# EAGLE design Fermento_1side (EAGLE 6.5.0)
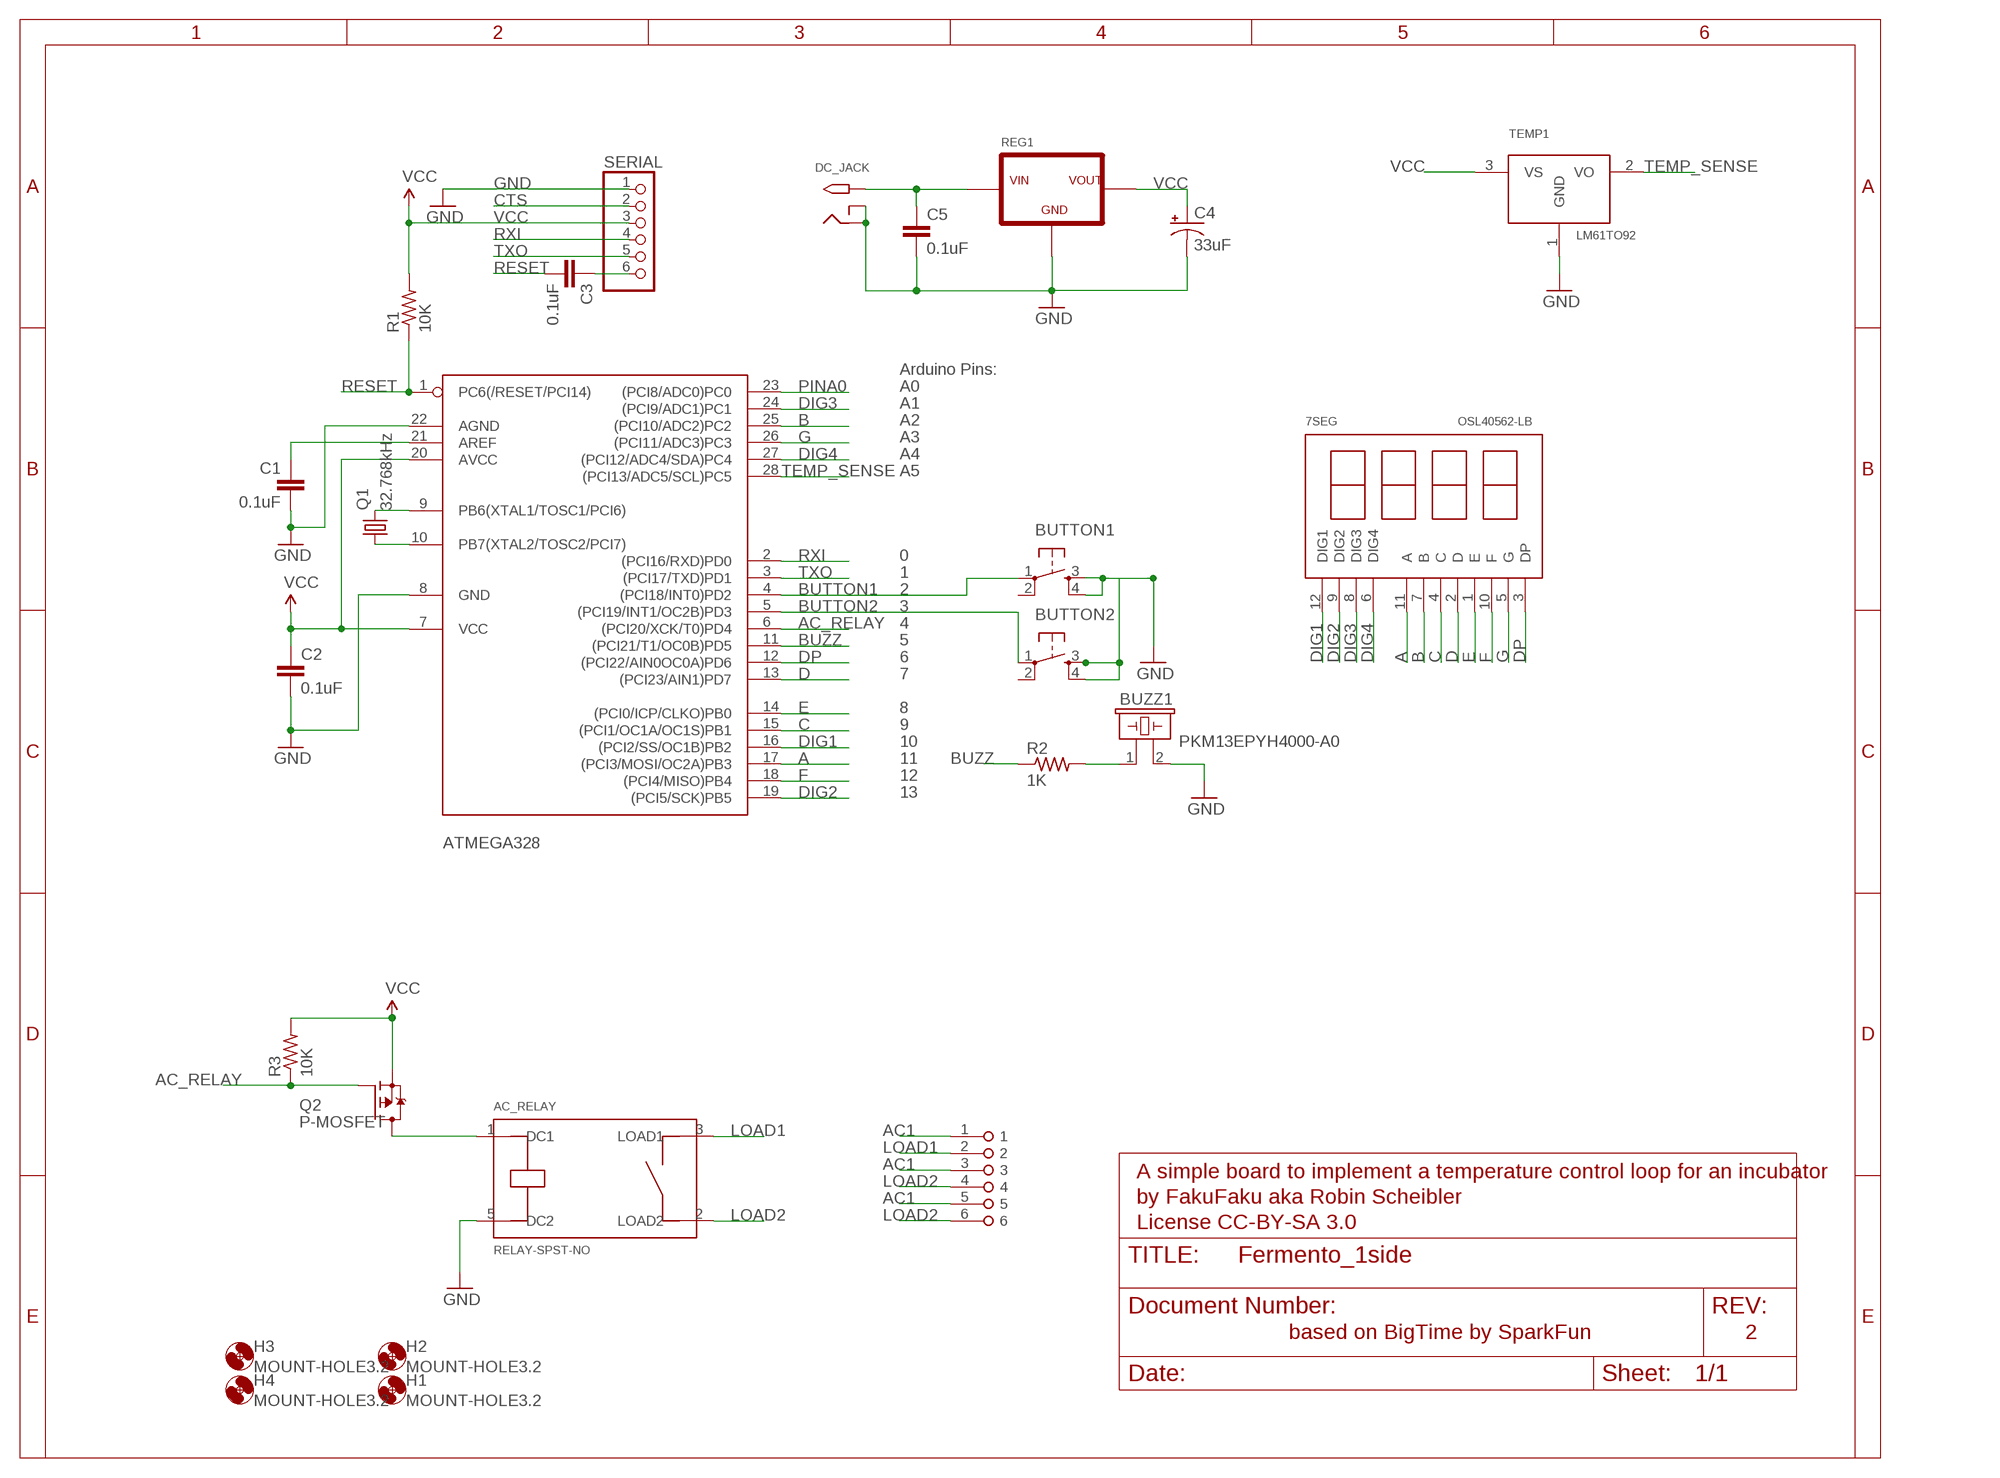
[diagram p0: schematic, sheet 1]

## Parts
7SEG  OSL40562-LB  7SEG  [OSL40562]
AC_RELAY  RELAY-SPST-NO  [G6RL-1A-DC3]
ATMEGA328  ATMEGA168-20P  [DIL28-3]
BUTTON1  TAC_SWITCHPTH  [TACTILE-PTH]
BUTTON2  TAC_SWITCHPTH  [TACTILE-PTH]
BUZZ1  PKM13EPYH4000-A0  BUZZER13MM  [PIEZO-MURATA-13MM]
C1  0.1uF  CAPPTH  [CAP-PTH-SMALL]
C2  0.1uF  CAPPTH  [CAP-PTH-SMALL]
C3  0.1uF  CAPPTH  [CAP-PTH-SMALL]
C4  33uF  CAP_POLPTH2  [CPOL-RADIAL-10UF-25V]
C5  0.1uF  CAPPTH  [CAP-PTH-SMALL]
DC_JACK  2.1MMJACKTHM  [PJ-102A]
H1  MOUNT-HOLE3.2  [3,2]
H2  MOUNT-HOLE3.2  [3,2]
H3  MOUNT-HOLE3.2  [3,2]
H4  MOUNT-HOLE3.2  [3,2]
Q1  32.768kHz  CRYSTAL8X3  [CRYSTAL-8X3-TH]
Q2  P-MOSFET  [TO92-]
R1  10K  R-US_0207/10  [0207/10]
R2  1K  R-US_0207/10  [0207/10]
R3  10K  R-US_0207/10  [0207/10]
REG1  REGULATOR-NOTHERMAL-TO220-STRAIGHT  [TO-220-STRAIGHT]
SERIAL  PINHD-1X6/90  [1X06/90]
TEMP1  LM61TO92  [TO92-]
U$2  TERMINAL-6  [MBE-156]

## Nets
A: 7SEG.11(A) ATMEGA328.17((PCI3/MOSI/OC2A)PB3)
AC1: U$2.1 U$2.3 U$2.5
AC_RELAY: ATMEGA328.6((PCI20/XCK/T0)PD4) Q2.2(G) R3.1
AREF: ATMEGA328.21(AREF) C1.1
B: 7SEG.7(B) ATMEGA328.25((PCI10/ADC2)PC2)
BUTTON1: ATMEGA328.4((PCI18/INT0)PD2) BUTTON1.1
BUTTON2: ATMEGA328.5((PCI19/INT1/OC2B)PD3) BUTTON2.1
BUZZ: ATMEGA328.11((PCI21/T1/OC0B)PD5) R2.1
C: 7SEG.4(C) ATMEGA328.15((PCI1/OC1A/OC1S)PB1)
CTS: SERIAL.2
D: 7SEG.2(D) ATMEGA328.13((PCI23/AIN1)PD7)
DIG1: 7SEG.12(DIG1) ATMEGA328.16((PCI2/SS/OC1B)PB2)
DIG2: 7SEG.9(DIG2) ATMEGA328.19((PCI5/SCK)PB5)
DIG3: 7SEG.8(DIG3) ATMEGA328.24((PCI9/ADC1)PC1)
DIG4: 7SEG.6(DIG4) ATMEGA328.27((PCI12/ADC4/SDA)PC4)
DP: 7SEG.3(DP) ATMEGA328.12((PCI22/AIN0OC0A)PD6)
E: 7SEG.1(E) ATMEGA328.14((PCI0/ICP/CLKO)PB0)
F: 7SEG.10(F) ATMEGA328.18((PCI4/MISO)PB4)
G: 7SEG.5(G) ATMEGA328.26((PCI11/ADC3)PC3)
GND: AC_RELAY.5(DC2) ATMEGA328.8(GND) ATMEGA328.22(AGND) BUTTON1.3 BUTTON1.4 BUTTON2.3 BUTTON2.4 BUZZ1.2 C1.2 C2.2 C4.2(-) C5.2 DC_JACK.RING DC_JACK.RING_SW REG1.CENTER(GND) SERIAL.1 TEMP1.1(GND)
LOAD1: AC_RELAY.3(LOAD1) U$2.2
LOAD2: AC_RELAY.2(LOAD2) U$2.4 U$2.6
N$1: ATMEGA328.9(PB6(XTAL1/TOSC1/PCI6)) Q1.2
N$2: ATMEGA328.10(PB7(XTAL2/TOSC2/PCI7)) Q1.1
N$3: C5.1 DC_JACK.TIP REG1.LEFT(VIN)
N$7: C3.1 SERIAL.6
N$13: BUZZ1.1 R2.2
PINA0: ATMEGA328.23((PCI8/ADC0)PC0)
RELAY: AC_RELAY.1(DC1) Q2.1(D)
RESET: ATMEGA328.1(PC6(/RESET/PCI14)) C3.2 R1.1
RXI: ATMEGA328.2((PCI16/RXD)PD0) SERIAL.4
TEMP_SENSE: ATMEGA328.28((PCI13/ADC5/SCL)PC5) TEMP1.2(VO)
TXO: ATMEGA328.3((PCI17/TXD)PD1) SERIAL.5
VCC: ATMEGA328.7(VCC) ATMEGA328.20(AVCC) C2.1 C4.1(+) Q2.3(S) R1.2 R3.2 REG1.RIGHT(VOUT) SERIAL.3 TEMP1.3(VS)
Unconnected: BUTTON1.2 BUTTON2.2

## Notes on the sheet
- Arduino Pins:
- A0
- A1
- A2
- A3
- A4
- A5
- 0
- 1
- 2
- 3
- 4
- 5
- 6
- 7
- 8
- 9
- 10
- 11
- 12
- 13
- A simple board to implement a temperature control loop for an incubator
- by FakuFaku aka Robin Scheibler
- License CC-BY-SA 3.0
- based on BigTime by SparkFun | 2

## Library data of the parts
7SEG = Robin:7SEG
AC_RELAY = Robin:RELAY-SPST-NO
ATMEGA328 = adafruit:ATMEGA168*P: MICROCONTROLLER 16 kBytes FLASH 1 kBytes SRAM 512 Bytes EEPROM USART 8-channel 10 bit ADC
BUTTON1 BUTTON2 = SparkFun:TAC_SWITCH: Momentary Switch Button commonly used for reset or general input. Spark Fun Electronics SKU : COM-00097
BUZZ1 = Robin:BUZZER: BUZZER Source: muRata
C1-C3 C5 = SparkFun:CAP: Capacitor Standard 0603 ceramic capacitor, and 0.1" leaded capacitor.
C4 = SparkFun:CAP_POL: Capacitor Polarized These are standard SMD and PTH capacitors. Normally 10uF, 47uF, and 100uF in electrolytic and tantalum varieties. Always verify the external diameter of the through hole cap, it varies with capacity, voltage, and manufacturer. The EIA devices should be standard.
DC_JACK = adafruit:2.1MMJACK: 2.1mm x 5.5mm THM DC jack with internal switch. Digikey part #PJ-102A, 4UCON part #05537 2.1mm x 5.5mm SMT DC jack with internal switch. Digikey part #PJ-002A-SMT, 4UCON part #03267 By microbuilder.eu & adafruit.com
H1-H4 = holes:MOUNT-HOLE: MOUNTING HOLE with drill center marker
Q1 = Robin:CRYSTAL
Q2 = Robin:P-MOSFET
R1-R3 = adafruit:R-US_: RESISTOR, American symbol
REG1 = Robin:REGULATOR-NOTHERMAL
SERIAL = pinhead:PINHD-1X6: PIN HEADER
TEMP1 = Robin:LM61: The LM61 is a precision integrated-circuit temperature sensor that can sense a ?30°C to +100°C temperature range while operating from a single +2.7V supply. The LM61's output volt- age is linearly proportional to Celsius (Centigrade) tempera- ture (+10 mV/°C) and has a DC offset of +600 mV. The offset allows reading negative temperatures without the need for a negative supply. The nominal output voltage of the LM61 ranges from +300 mV to +1600 mV for a ?30°C to +100°C temperature range. The LM61 is calibrated to provide accu- racies of ±2.0°C at room temperature and ±3°C over the full ?25°C to +85°C temperature range.
U$2 = Robin:TERMINAL-6

## Board
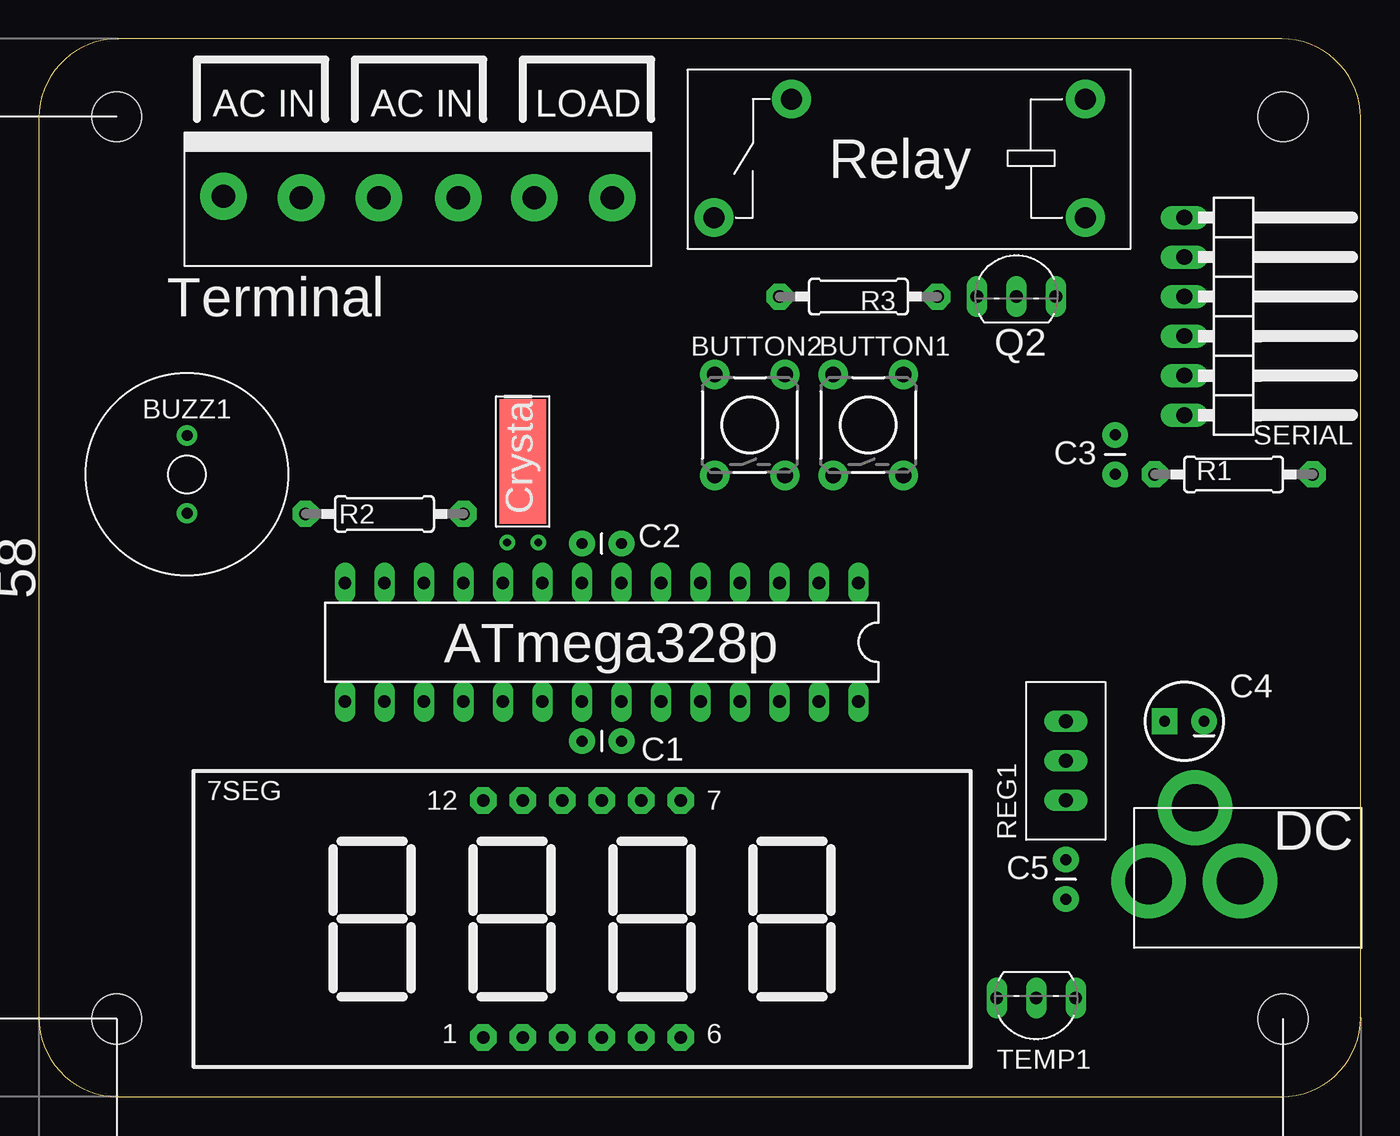
[diagram p1: board, top side]
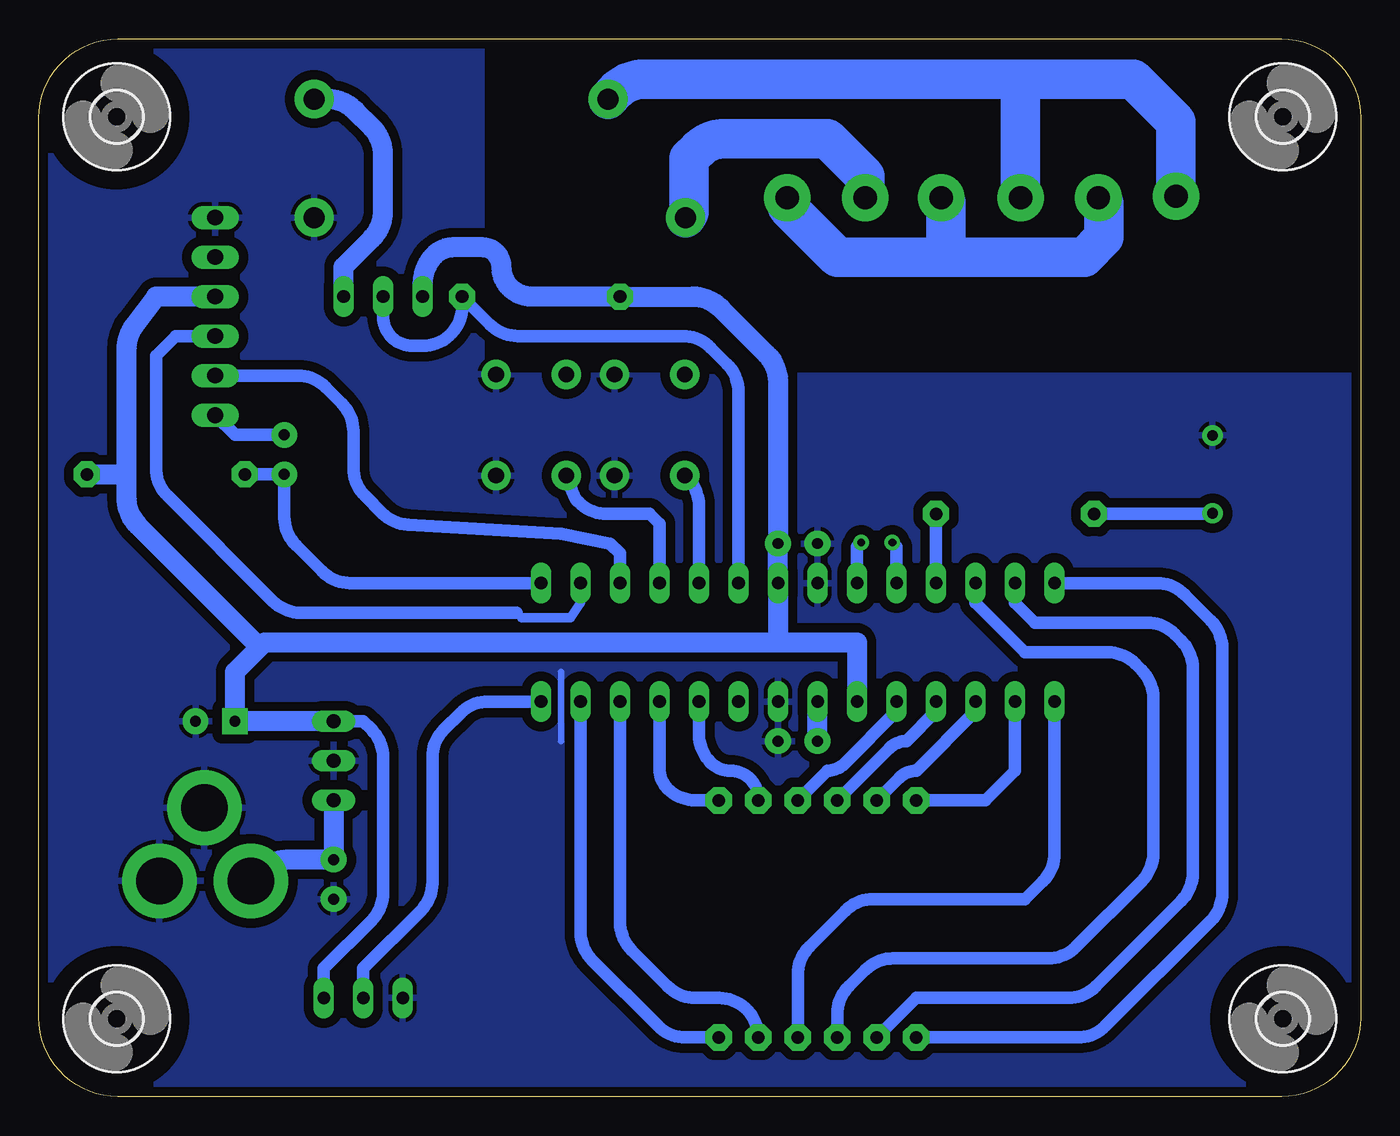
[diagram p2: board, bottom side, seen from below]

Size 85 x 68 mm. Coordinates in mm from the lower left corner, seen from the top.
Outline: 0,62.92 0,5.08 arc90 5.08,0 79.92,0 arc90 85,5.08 85,62.92 arc90 79.92,68 5.08,68 arc90 0,62.92
Copper layers (1*16): Top 0.035mm / dielectric 1.5mm / Bottom 0.035mm
Design rules "Fusion_eagle_rule_v1.1": minimum track width 6mil, minimum drill 12mil, track to track 6mil, track to pad 6mil, pad to pad 6mil, via to via 6mil, smd to smd 0mil, copper to edge 10mil, drill to drill 10mil, minimum pad ring 10mil, minimum via ring 6mil, stop-mask expansion 2mil, vias tented up to drill 100mil, thermal gap 10mil

### Footprints (pad centres in the part's own frame; a part is rotated, then mirrored left to right if it is on the bottom)
OSL40562 = drill 0.8 pad 1.7 octagon: 1 -6.35,-7.62; 2 -3.81,-7.62; 3 -1.27,-7.62; 4 1.27,-7.62; 5 3.81,-7.62; 6 6.35,-7.62; 7 6.35,7.62; 8 3.81,7.62; 9 1.27,7.62; 10 -1.27,7.62; 11 -3.81,7.62; 12 -6.35,7.62
G6RL-1A-DC3 = drill 1.35 pad 2.5: 1 0,-7.62; 2 18.9,-7.62; 3 23.9,0; 5 0,0
DIL28-3 = drill 0.813 long: 1 -16.51,-3.81; 2 -13.97,-3.81; 3 -11.43,-3.81; 4 -8.89,-3.81; 5 -6.35,-3.81; 6 -3.81,-3.81; 7 -1.27,-3.81; 8 1.27,-3.81; 9 3.81,-3.81; 10 6.35,-3.81; 11 8.89,-3.81; 12 11.43,-3.81; 13 13.97,-3.81; 14 16.51,-3.81; 15 16.51,3.81; 16 13.97,3.81; 17 11.43,3.81; 18 8.89,3.81; 19 6.35,3.81; 20 3.81,3.81; 21 1.27,3.81; 22 -1.27,3.81; 23 -3.81,3.81; 24 -6.35,3.81; 25 -8.89,3.81; 26 -11.43,3.81; 27 -13.97,3.81; 28 -16.51,3.81
TACTILE-PTH = drill 1.016 pad 1.88: 1 -3.251,2.261; 2 3.251,2.261; 3 -3.251,-2.261; 4 3.251,-2.261
PIEZO-MURATA-13MM = drill 0.7 pad 1.3: 1 -2.5,0; 2 2.5,0
CAP-PTH-SMALL = drill 0.7 pad 1.651: 1 0,0; 2 2.54,0
CPOL-RADIAL-10UF-25V = drill 0.7 pad 1.651 square: 1 1.27,0 | drill 0.7 pad 1.651: 2 -1.27,0
PJ-102A = drill 3 pad 4.8: RING 0.1,-3.39; RING_SW -4.6,-6.29; TIP 0.1,-9.29
3,2 = hole 3.2: 0,0
CRYSTAL-8X3-TH = drill 0.5 pad 0.8: 1 -1,-1.2; 2 1,-1.2 | smd 3 x 8: PLATE 0,4
TO92- = drill 0.813 long: 1 2.54,0; 2 0,0; 3 -2.54,0
0207/10 = drill 0.813 pad 1.676 octagon: 1 -5.08,0; 2 5.08,0
TO-220-STRAIGHT = drill 0.889 long: CENTER 0,0; LEFT -2.54,0; RIGHT 2.54,0
1X06/90 = drill 1.016 long: 1 -6.35,-3.81; 2 -3.81,-3.81; 3 -1.27,-3.81; 4 1.27,-3.81; 5 3.81,-3.81; 6 6.35,-3.81
MBE-156 = drill 1.5 pad 3: 1 2.5,0; 2 7.5,0; 3 12.4,0; 4 17.5,0; 5 22.5,0; 6 27.5,-0.1

### Placement (x,y rotation side)
7SEG  34.92,11.43 0 top
AC_RELAY  67.31,56.52 180 top
ATMEGA328  36.2,29.21 180 top
BUTTON1  53.34,43.18 90 top
BUTTON2  45.72,43.18 90 top
BUZZ1  9.53,40.01 90 top
C1  34.92,22.86 0 top
C2  37.47,35.56 180 top
C3  69.22,42.55 270 top
C4  73.66,24.13 180 top
C5  66.04,15.24 270 top
DC_JACK  80.64,13.97 270 top
H1  5,63 0 bottom
H2  80,63 0 bottom
H3  80,5 0 bottom
H4  5,5 0 bottom
Q1  31.11,36.83 0 top
Q2  62.87,51.44 0 top
R1  76.83,40.01 0 top
R2  22.23,37.47 180 top
R3  52.7,51.44 180 top
REG1  66.04,21.59 90 top
SERIAL  77.47,50.16 270 top
TEMP1  64.14,6.35 180 top
U$2  39.37,57.78 180 top

### Tracks (layer width: path | path; a pad name or v marks a point on that pad's centre or on a via)
A
  Bottom 0.813: ATMEGA328.17 24.77,24.77 28.57,20.95 arc-45 29.66,20.51 7SEG.11
AC1
  Bottom 2.54: 26.04,53.98 26.67,54.61 26.67,57.48 U$2.3 | U$2.1 36.87,57.19 33.66,53.98 26.04,53.98 | 26.04,53.98 17.78,53.98 16.51,55.24 16.51,57.42 U$2.5
AC_RELAY
  Bottom 0.813: ATMEGA328.6 40.01,45.3 arc-45 40.75,47.1 41.8,48.15 arc-45 43.6,48.9 54.19,48.9 arc45 55.99,49.64 R3.1 57.78,50.8 arc90 60.33,48.26 60.96,48.26 arc90 62.87,50.16 Q2.2
AREF
  Bottom 1.27: C1.1 ATMEGA328.21
B
  Bottom 0.813: 7SEG.7 42.76,19.05 arc45 44.56,19.79 arc45 45.09,21.06 ATMEGA328.25
BUTTON1
  Bottom 0.813: ATMEGA328.4 45.09,36.83 45.72,37.47 48.48,37.47 arc45 50.27,38.21 arc45 50.8,39.48 50.8,39.65 BUTTON1.1
BUTTON2
  Bottom 0.813: ATMEGA328.5 42.55,37.96 arc-45 43.29,39.76 BUTTON2.1
BUZZ
  Bottom 0.813: ATMEGA328.11 R2.1
C
  Bottom 0.813: ATMEGA328.15 19.68,15.66 arc45 20.43,13.86 21.59,12.7 31.33,12.7 arc-45 33.13,11.96 35.45,9.63 arc-45 36.2,7.84 7SEG.4
D
  Bottom 0.813: ATMEGA328.13 22.23,31.75 20.95,30.48 13.75,30.48 arc45 11.96,29.74 11.54,29.32 arc45 10.79,27.52 10.79,14.39 arc45 11.54,12.59 17.04,7.09 arc45 18.83,6.35 28.57,6.35 7SEG.2
DIG1
  Bottom 0.813: ATMEGA328.16 22.23,20.95 24.13,19.05 7SEG.12
DIG2
  Bottom 0.813: ATMEGA328.19 29.84,24.77 33.21,21.4 arc45 34.29,20.95 7SEG.9
DIG3
  Bottom 0.813: ATMEGA328.24 42.55,23.28 arc-45 41.8,21.48 arc-45 40.53,20.95 arc90 38.73,19.16 7SEG.8
DIG4
  Bottom 0.813: ATMEGA328.27 50.16,10.58 arc-45 49.42,8.78 45.19,4.55 arc-45 43.4,3.81 7SEG.6
DP
  Bottom 0.813: ATMEGA328.12 24.77,31.75 21.59,28.57 16.29,28.57 arc45 14.5,27.83 14.08,27.41 arc45 13.34,25.62 13.34,15.66 arc45 14.08,13.86 18.31,9.63 arc45 20.1,8.89 30.06,8.89 arc-45 31.86,8.15 32.91,7.09 arc-45 33.66,5.3 7SEG.3
E
  Bottom 0.813: ATMEGA328.14 13.12,33.02 arc45 11.32,32.28 9.63,30.59 arc45 8.89,28.79 8.89,13.12 arc45 9.63,11.32 16.4,4.55 arc45 18.2,3.81 7SEG.1
F
  Bottom 0.813: ATMEGA328.18 27.3,24.77 29.21,22.86 arc-45 30.29,22.41 7SEG.10
G
  Bottom 0.813: ATMEGA328.26 47.62,11.21 arc-45 46.88,9.42 44.56,7.09 arc-45 42.76,6.35 41.27,6.35 arc90 7SEG.5
GND
  Bottom 0.406: 51.44,27.3 51.44,22.86
  pour Bottom (isolate 0.61): -5.08,-5.71 87.63,-5.71 87.63,69.85 56.52,69.85 56.52,46.35 -5.08,46.35
LOAD1
  Bottom 2.54: U$2.2 31.87,59.17 34.29,61.59 40.86,61.59 arc-45 42.65,60.85 43.18,60.33 43.18,57.07 arc45 AC_RELAY.3
LOAD2
  Bottom 2.54: 21.59,65.41 14.61,65.41 11.87,62.67 U$2.6 | 21.59,65.41 46.09,65.41 arc-45 47.88,64.66 AC_RELAY.2 | 21.59,65.41 21.87,65.12 U$2.4
N$1
  Bottom 0.813: ATMEGA328.9 32.38,35.36 Q1.2
N$2
  Bottom 0.813: ATMEGA328.10 29.84,35.36 Q1.1
N$3
  Bottom 1.27: REG1.LEFT C5.1 68.93,15.24 arc-45 70.73,14.5 DC_JACK.TIP
N$7
  Bottom 0.813: C3.1 72.39,42.55 SERIAL.6
N$13
  Bottom 0.813: R2.2 9.56,37.47 BUZZ1.1
RELAY
  Bottom 1.27: Q2.1 65.41,53.34 63.61,55.14 arc-45 62.87,56.93 62.87,60.54 arc-45 63.61,62.34 64.66,63.39 arc-45 66.46,64.14 AC_RELAY.1
RESET
  Bottom 0.813: ATMEGA328.1 64.99,33.02 arc45 66.78,33.76 68.47,35.45 arc45 69.22,37.25 C3.2 R1.1
RXI
  Bottom 0.406: 53.98,30.8 54.29,31.11
  Bottom 0.61: 53.98,30.8 50.8,30.8 50.16,31.75 ATMEGA328.2
  Bottom 0.813: SERIAL.4 76.2,48.9 77.47,47.62 77.47,40.42 arc-45 76.73,38.63 69.96,31.86 arc-45 68.16,31.11 54.29,31.11
TEMP_SENSE
  Bottom 0.406: ATMEGA328.28 52.7,26.04
  Bottom 0.813: TEMP1.2 64.14,8.26 60.43,11.96 arc-45 59.69,13.75 59.69,21.81 arc45 58.95,23.6 57.89,24.66 arc45 56.1,25.4 ATMEGA328.28
TXO
  Bottom 0.813: ATMEGA328.3 47.62,34.92 48.26,35.56 51.44,36.2 61.27,36.77 arc42 62.91,37.51 64.03,38.63 arc45 64.77,40.42 64.77,42.76 arc-45 65.51,44.56 66.57,45.61 arc-45 68.36,46.35 SERIAL.5
VCC
  Bottom 0.813: TEMP1.3 66.67,8.26 63.61,11.32 arc-45 62.87,13.12 62.87,21.81 arc-45 63.61,23.6 64.14,24.13 REG1.RIGHT
  Bottom 1.27: 37.47,29.21 ATMEGA328.7 C2.1 37.47,45.94 arc-45 38.21,47.73 41.17,50.69 arc-45 42.96,51.44 R3.2 53.34,51.44 arc90 55.24,53.34 arc-90 56.52,54.61 58.31,54.61 arc-45 59.58,54.08 arc-45 60.33,52.29 Q2.3 | 37.47,29.21 32.38,29.21 ATMEGA328.20 | SERIAL.3 77.47,51.44 78.87,49.57 arc-37 79.38,48.05 79.38,40.01 | 37.47,29.21 70.48,29.21 70.8,28.89 | REG1.RIGHT C4.1 72.39,27.3 70.8,28.89 | R1.2 79.38,40.01 | 79.38,40.01 79.38,38.52 arc-45 78.63,36.72 70.8,28.89

### Text on the board
tPlace: AC IN | AC IN | LOAD | Drill diameters | Relay | Terminal | Crystal | ATmega328p | DC
tDocu: Buzzer+Crystal: 0.5mm | Mount Holes: 3.2mm | Relay: 1.35mm | Terminal: 1.5mm | Regulator: 4mm | Buttons: 1mm | DC Jack: 3mm | All other drills: 0.9mm | R1,R3: 10K | R2: 1K | C1,C2,C3,C5: 0.1uF | C4: 47uF